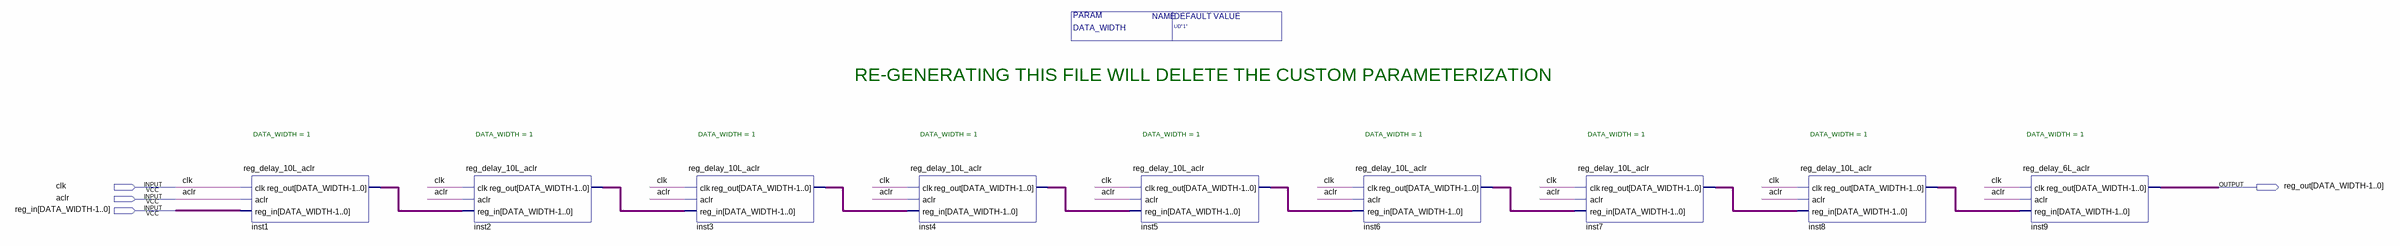
[diagram p0: schematic sheet]
// Quartus schematic reg_delay_86L_aclr.bdf as structural Verilog: 9 symbols, 4 pins
module reg_delay_86L_aclr #(parameter DATA_WIDTH = "UD\"1\"") (
  input  clk,
  input  aclr,
  input  \reg_in[DATA_WIDTH-1..0] ,
  output \reg_out[DATA_WIDTH-1..0] 
);

  wire inst1_reg_out, inst2_reg_out, inst3_reg_out, inst4_reg_out, inst5_reg_out, inst6_reg_out,
       inst7_reg_out, inst8_reg_out;

  reg_delay_10L_aclr #(.DATA_WIDTH(1)) inst1 (
    .clk(clk), .aclr(aclr), .reg_in(\reg_in[DATA_WIDTH-1..0] ), .reg_out(inst1_reg_out));
  reg_delay_10L_aclr #(.DATA_WIDTH(1)) inst2 (.clk(clk), .aclr(aclr), .reg_in(inst1_reg_out), .reg_out(inst2_reg_out));
  reg_delay_10L_aclr #(.DATA_WIDTH(1)) inst3 (.clk(clk), .aclr(aclr), .reg_in(inst2_reg_out), .reg_out(inst3_reg_out));
  reg_delay_10L_aclr #(.DATA_WIDTH(1)) inst4 (.clk(clk), .aclr(aclr), .reg_in(inst3_reg_out), .reg_out(inst4_reg_out));
  reg_delay_10L_aclr #(.DATA_WIDTH(1)) inst5 (.clk(clk), .aclr(aclr), .reg_in(inst4_reg_out), .reg_out(inst5_reg_out));
  reg_delay_10L_aclr #(.DATA_WIDTH(1)) inst6 (.clk(clk), .aclr(aclr), .reg_in(inst5_reg_out), .reg_out(inst6_reg_out));
  reg_delay_10L_aclr #(.DATA_WIDTH(1)) inst7 (.clk(clk), .aclr(aclr), .reg_in(inst6_reg_out), .reg_out(inst7_reg_out));
  reg_delay_10L_aclr #(.DATA_WIDTH(1)) inst8 (.clk(clk), .aclr(aclr), .reg_in(inst7_reg_out), .reg_out(inst8_reg_out));
  reg_delay_6L_aclr #(.DATA_WIDTH(1)) inst9 (
    .clk(clk), .aclr(aclr), .reg_in(inst8_reg_out), .reg_out(\reg_out[DATA_WIDTH-1..0] ));

  // Notes on the sheet:
  //   RE-GENERATING THIS FILE WILL DELETE THE CUSTOM PARAMETERIZATION
endmodule
